# Altium schematic sheet harvester.SchDoc
size A; SheetNumber: 2; SheetTotal: 4
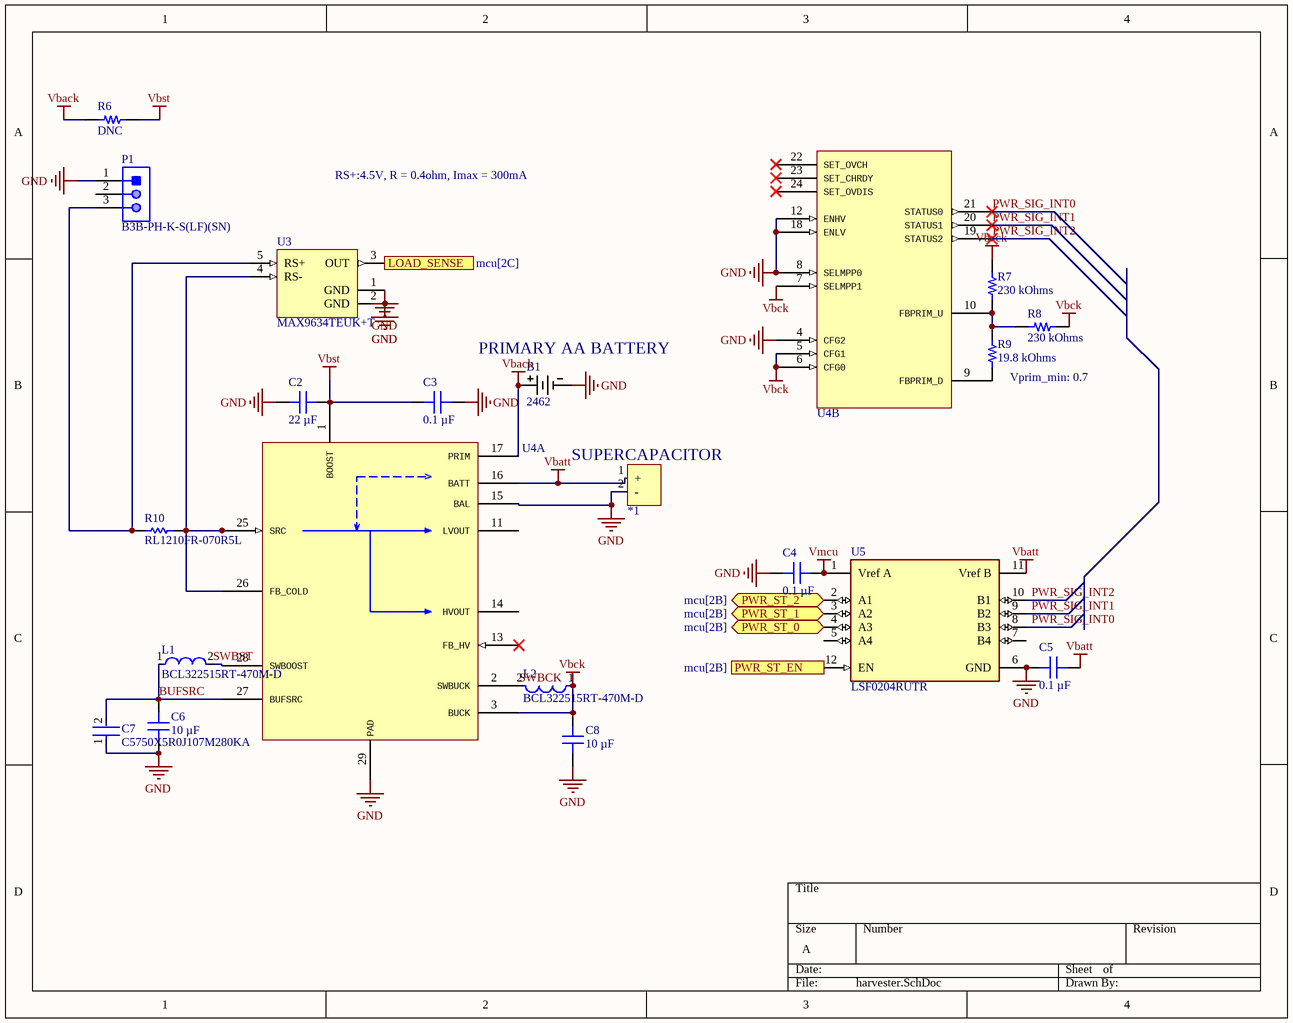
[diagram p0: harvester.SchDoc]

## Parts
*1  FC0H474ZFTBR32-SS  [FC0H474ZFTBR32-SS-Footprint-1]  (value not drawn)
B1  2462  [2462_KEY]
C2  22 µF  [CAP 0603_1608]
C3  0.1 µF  [CAP 0402_1005]
C4  0.1 µF  [CAP 0402_1005]
C5  0.1 µF  [CAP 0402_1005]
C6  10 µF  [CAP 0603_1608]
C7  C5750X5R0J107M280KA  [FP-C5750-280-0_4-IPC_A]
C8  10 µF  [CAP 0603_1608]
L1  BCL322515RT-470M-D  [FP-BCL322515-IPC_C]
L2  BCL322515RT-470M-D  [FP-BCL322515-IPC_C]
P1  B3B-PH-K-S(LF)(SN)  [JST-B3B-PH-K-S-3_V]
R6  DNC  [RES 0402_1005]
R7  230 kOhms  [RES 0402_1005]
R8  230 kOhms  [RES 0402_1005]
R9  19.8 kOhms  [RES 0402_1005]
R10  RL1210FR-070R5L  [RESC3126X65X50NL10T20]
U3  MAX9634TEUK+T  [MAXM-U5+2_L]
U4  AEM10941 - Symbol QFN28  [QFN28 5x5mm Pitch=0.5mm ThPad=3.15x3.15mm]  (value not drawn)  (parts A,B of 2)
U5  LSF0204RUTR  [FP-RUT0012A-MFG]

## Ports
LOAD_SENSE (see mcu[2C]), PWR_ST_0 (bidir, see mcu[2B]), PWR_ST_1 (bidir, see mcu[2B]), PWR_ST_2 (bidir, see mcu[2B]), PWR_ST_EN (in, see mcu[2B])

## Nets
GND: *1.2(-) B1.1 C2.1 C3.1 C4.1 C5.2 C6.1 C7.1 C8.2 P1.1 U3.1(GND) U3.2(GND) U4.4(CFG2) U4.8(SELMPP0) U4.12(ENHV) U4.15(BAL) U4.18(ENLV) U4.29(PAD) U5.6(GND)
Vback: B1.2 R6.2 R7.2 U4.17(PRIM)
Vbatt: *1.1(+) C5.1 U4.16(BATT) U5.11(Vref_B)
Vbck: C8.1 L2.1 R8.2 U4.3(BUCK) U4.5(CFG1) U4.6(CFG0) U4.7(SELMPP1)
Vbst: C2.2 C3.2 R6.1 U4.1(BOOST)
Vmcu: C4.2 U5.1(Vref_A)
BUFSRC: C6.2 C7.2 L1.1 U4.27(BUFSRC)
LOAD_SENSE: U3.3(OUT) ; port LOAD_SENSE
PWR_SIG_INT0: U4.21(STATUS0) U5.8(B3)
PWR_SIG_INT1: U4.20(STATUS1) U5.9(B2)
PWR_SIG_INT2: U4.19(STATUS2) U5.10(B1)
PWR_ST_0: U5.4(A3) ; port PWR_ST_0
PWR_ST_1: U5.3(A2) ; port PWR_ST_1
PWR_ST_2: U5.2(A1) ; port PWR_ST_2
PWR_ST_EN: U5.12(EN) ; port PWR_ST_EN
SWBCK: L2.2 U4.2(SWBUCK)
SWBST: L1.2 U4.28(SWBOOST)
NetP1_3: P1.3 R10.1 U3.5(RS+)
NetR7_1: R7.1 R8.1 R9.1 U4.10(FBPRIM_U)
NetR9_2: R9.2 U4.9(FBPRIM_D)
NetR10_2: R10.2 U3.4(RS-) U4.25(SRC) U4.26(FB_COLD)

Not connected (* = marked no-connect by the designer): P1 2; U4 11(LVOUT) 13(FB_HV)* 14(HVOUT) 22(SET_OVCH)* 23(SET_CHRDY)* 24(SET_OVDIS)*; U5 5(A4) 7(B4)

## Notes on the sheet
- RS+:4.5V, R = 0.4ohm, Imax = 300mA
- (near B1) PRIMARY AA BATTERY
- (near R9) Vprim_min: 0.7
- (near *1) SUPERCAPACITOR

## Library data of the parts
*1 = CMP-001-00083-1: Cap Supercap 0.47F 5.5V -20% to 80% (16 X 9.5mm) SMD Cylindrical 13 Ohm 70C T/R
B1 = 2462: No Description Available; Mfr_Name: Keystone Electronics
C2 = GRM188R60J106ME47D: CAP CER 22UF 6.3V X5R 0603; manufacturer: Murata Electronics; Tolerance: ±20%; Part Number: GRM188R60J106ME47D; Value: 22 µF; Applications: General Purpose; Capacitance: 22 µF; componentlink1description: Datasheet; componentlink1url: https://www.murata.com/~/media/webrenewal/support/library/catalog/products/capacitor/mlcc/c02e.ashx?la=en-us; componentlink2description: DigiKey Link; componentlink2url: https://www.digikey.com/en/products/detail/murata-electronics/GRM188R60J106ME47D/965910; Device Package: 0603 (1608 Metric); lastupdated: 11/9/2022 9:40:24 am; Lifecycle Status: Active; Minimum Order: 1; Mounting Type: Surface Mount, MLCC; Operating Temperature: -55°C ~ 85°C; Package / Case: 0603 (1608 Metric); packaging: TapeAndReel; partid: 2351; Part Status: Active; price: 0.02; series: GRM; Size / Dimension: 0.063" L x 0.031" W (1.60mm x 0.80mm); Supplier 1: DigiKey; Supplier Part Number 1: 490-3896-1-ND; Temperature Coefficient: X5R; Thickness (Max): 0.035" (0.90mm); Voltage - Rated: 6.3V
C3-C5 = C0402C104K7PAC7867: CAP CER 0.1UF 4V X5R 0402; manufacturer: KEMET; Tolerance: ±10%; Part Number: C0402C104K7PAC7867; Value: 0.1 µF; Applications: Bypass, Decoupling; Capacitance: 0.1 µF; componentlink1description: Datasheet; componentlink1url: https://api.kemet.com/component-edge/download/datasheet/C0402C104K7PAC7867.pdf; componentlink2description: DigiKey Link; componentlink2url: https://www.digikey.com/en/products/detail/kemet/C0402C104K7PAC7867/7381987; Device Package: 0402 (1005 Metric); lastupdated: 1/9/2022 12:30:40 pm; Lifecycle Status: Active; Minimum Order: 1; Mounting Type: Surface Mount, MLCC; Operating Temperature: -55°C ~ 85°C; Package / Case: 0402 (1005 Metric); packaging: TapeAndReel; partid: 5603; Part Status: Active; price: 0.01; series: SMD Comm X5R; Size / Dimension: 0.039" L x 0.020" W (1.00mm x 0.50mm); Supplier 1: DigiKey; Supplier Part Number 1: 399-14871-1-ND; Temperature Coefficient: X5R; Thickness (Max): 0.022" (0.55mm); Voltage - Rated: 4V
C6 C8 = GRM188R60J106ME47D: CAP CER 10UF 6.3V X5R 0603; manufacturer: Murata Electronics; Tolerance: ±20%; Part Number: GRM188R60J106ME47D; Value: 10 µF; Applications: General Purpose; Capacitance: 10 µF; componentlink1description: Datasheet; componentlink1url: https://www.murata.com/~/media/webrenewal/support/library/catalog/products/capacitor/mlcc/c02e.ashx?la=en-us; componentlink2description: DigiKey Link; componentlink2url: https://www.digikey.com/en/products/detail/murata-electronics/GRM188R60J106ME47D/965910; Device Package: 0603 (1608 Metric); lastupdated: 11/9/2022 9:40:24 am; Lifecycle Status: Active; Minimum Order: 1; Mounting Type: Surface Mount, MLCC; Operating Temperature: -55°C ~ 85°C; Package / Case: 0603 (1608 Metric); packaging: TapeAndReel; partid: 2351; Part Status: Active; price: 0.02; series: GRM; Size / Dimension: 0.063" L x 0.031" W (1.60mm x 0.80mm); Supplier 1: DigiKey; Supplier Part Number 1: 490-3896-1-ND; Temperature Coefficient: X5R; Thickness (Max): 0.035" (0.90mm); Voltage - Rated: 6.3V
C7 = CMP-08246-006651-1: Multilayer Ceramic Capacitors 100uF ±20% 6.3V X5R SMD 2220; Min Operating Temperature: -55°C; Height: 2.8mm; Case/Package: 2220; Resistor Type: Ceramic; Construction: Flat; Max Operating Temperature: 85°C; REACH SVHC: No SVHC; Length: 5.7mm; Width: 0.197inch; Thickness: 0.122inch; Case Code (Imperial): 2220; Number of Pins: 2; Weight: 0.016932oz; Dielectric Material: Ceramic; Dielectric: X5R; Depth: 5mm; Capacitance: 100uF; Voltage Rating (DC): 6.3V; Package Quantity: 1; Packaging: Tape and Reel; Case Code (Metric): 5750; Lead Free: Lead Free; RoHS Compliant: Yes; Series: C; Termination: SMD/SMT; Tolerance: 20%; Mount: Surface Mount; Voltage Rating: 6.3V
L1 L2 = CMP-08253-000181-1: FIXED IND 47UH 670MA 1.4 OHM SMD
P1 = CMP-2000-05164-1: Male Header, Pitch 2 mm, 1 x 3 Position, Height 6 mm, Tail Length 3.4 mm, -25 to 85 degC, RoHS, Bulk; Manufacturer: JST; Style/Orientation: StraightHeader/Plug; Pitch: 2mm; No of Positions: 3; Termination: Crimp; Manufacturer URL: http://www.jst.com/home2.html; Datasheet Version: Oct-06; Type: ShroudedHeader; Datasheet URL: https://datasheet.ciiva.com/11746/0900766b80826550-11746939.pdf
R6 = ERA-2VRW1501X: RES 1.5K OHM 0.05% 1/10W 0402; Manufacturer: Panasonic Electronic Components; Power (Watts): 0.1W, 1/10W; Resistance: 1.5 kOhms; Temperature Coefficient: ±10ppm/°C; Part Number: ERA-2VRW1501X; Value: DNC; ComponentLink1Description: Datasheet; ComponentLink1URL: https://api.pim.na.industrial.panasonic.com/file_stream/main/fileversion/9152; ComponentLink2Description: DigiKey Link; ComponentLink2URL: https://www.digikey.com/en/products/detail/panasonic-electronic-components/ERA-2VRW1501X/12086957; Composition: Thin Film; Device Package: 0402 (1005 Metric); Features: Anti-Sulfur, Automotive AEC-Q200; Height - Seated (Max): 0.016" (0.40mm); LastUpdated: 11/9/2022 9:53:08 am; Lifecycle Status: Active; Minimum Order: 1; Number of Terminations: 2; Operating Temperature: -55°C ~ 155°C; Package / Case: 0402 (1005 Metric); Packaging: TapeAndReel; PartId: 67400; Part Status: Active; Price: 0.24; Ratings: AEC-Q200; Series: ERA-2V; Size / Dimension: 0.039" L x 0.020" W (1.00mm x 0.50mm); Supplier 1: DigiKey; Supplier Part Number 1: 10-ERA-2VRW1501XCT-ND; Supplier Device Package: 0402; Tolerance: ±0.05%
R7-R9 = RP73PF1E10KBTD: RES 10K OHM 0.1% 1/10W 0402; Manufacturer: TE Connectivity Passive Product; Power (Watts): 0.1W, 1/10W; Resistance: 10 kOhms; Temperature Coefficient: ±25ppm/°C; Part Number: RP73PF1E10KBTD; ComponentLink1Description: Datasheet; ComponentLink1URL: https://www.te.com/commerce/DocumentDelivery/DDEController?Action=srchrtrv&DocNm=1773272&DocType=DS&DocLang=English; ComponentLink2Description: DigiKey Link; ComponentLink2URL: https://www.digikey.com/en/products/detail/te-connectivity-passive-product/RP73PF1E10KBTD/8260957; Composition: Thin Film; Device Package: 0402 (1005 Metric); Height - Seated (Max): 0.014" (0.35mm); LastUpdated: 1/9/2022 12:46:57 pm; Lifecycle Status: Active; Minimum Order: 1; Number of Terminations: 2; Operating Temperature: -55°C ~ 155°C; Package / Case: 0402 (1005 Metric); Packaging: TapeAndReel; PartId: 2434; Part Status: Active; Price: 0.09; Series: RP73, Holsworthy; Size / Dimension: 0.039" L x 0.020" W (1.00mm x 0.50mm); Supplier 1: DigiKey; Supplier Part Number 1: A127415CT-ND; Supplier Device Package: 0402; Tolerance: ±0.1%
  R7 R8: Value: 230 kOhms
  R9: Value: 19.8 kOhms
R10 = CMP-2005-02088-1: Manufacturer: Yageo; Part Number: RL1210FR-070R5L
U3 = CMP-0252-00051-2: 1 uA, 4-Bump, Precision Current-Sense Amplifier, 25 V / V Gain, -40 to 85 degC, 5-Pin SOT23 (U5+2), Pb-Free, Tape and Reel; Gain: 25 V/V, 50 V/V ,100 V/V ,200 V/V; Bi-Dir. Curr. Sense: No; Code_JEDEC: MO178; PackageReference: U5+2; PackageDescription: 5-Pin Small-Outline Transistor Package, Body 1.625 x 2.9 mm, Pitch 0.95 mm; Mounting Technology: Surface Mount; ComponentLink3URL: http://pdfserv.maximintegrated.com/package_dwgs/21-0057.PDF; ComponentLink1URL: http://www.maximintegrated.com/; ComponentLink2Description: Datasheet; ComponentLink1Description: Manufacturer URL; PartNumber: MAX9634TEUK+T; PackageVersion: Rev. G, 04/2011; ComponentLink3Description: Package Specification; ComponentLink2URL: http://datasheets.maximintegrated.com/en/ds/MAX9634.pdf; DatasheetVersion: Rev. 2
U5 = CMP-04899-000054-1: IC TRNSLTR BIDIRECTIONAL 12UQFN; Number of Bits: 4; Quiescent Current: 3.5uA; Min Supply Voltage: 1V; Propagation Delay: 1.5ns; Output Type: TTL; Number of Circuits: 1; Max Supply Voltage: 5.5V; Logic Function: Translator; RoHS Compliant: Yes; Package Quantity: 3000; Channel Type: Bidirectional; Mount: Surface Mount; Packaging: Tape and Reel; Operating Supply Current: 3.5uA; Max Operating Temperature: 125°C; Min Operating Temperature: -40°C; Lead Free: Lead Free; Number of Pins: 12